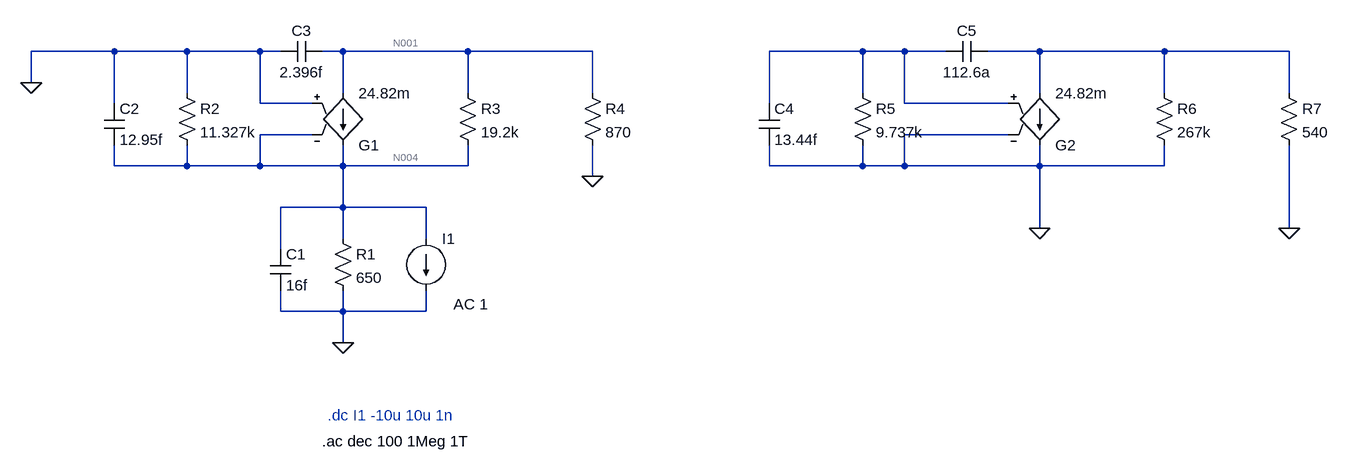
[diagram p0: schematic Draft2.asc]
Draft2.asc, the LTspice schematic file:
Version 4
SHEET 1 1604 680
WIRE -272 16 -400 16
WIRE -160 16 -272 16
WIRE -48 16 -160 16
WIRE -16 16 -48 16
WIRE 80 16 48 16
WIRE 272 16 80 16
WIRE 464 16 272 16
WIRE 880 16 736 16
WIRE 944 16 880 16
WIRE 1008 16 944 16
WIRE 1152 16 1072 16
WIRE 1344 16 1152 16
WIRE 1536 16 1344 16
WIRE -400 64 -400 16
WIRE -160 80 -160 16
WIRE 80 80 80 16
WIRE 272 80 272 16
WIRE 464 80 464 16
WIRE 880 80 880 16
WIRE 1152 80 1152 16
WIRE 1344 80 1344 16
WIRE 1536 80 1536 16
WIRE -272 96 -272 16
WIRE -48 96 -48 16
WIRE 32 96 -48 96
WIRE 736 96 736 16
WIRE 944 96 944 16
WIRE 1104 96 944 96
WIRE 32 144 -48 144
WIRE 1104 144 944 144
WIRE -272 192 -272 160
WIRE -160 192 -160 160
WIRE -160 192 -272 192
WIRE -48 192 -48 144
WIRE -48 192 -160 192
WIRE 80 192 80 160
WIRE 80 192 -48 192
WIRE 272 192 272 160
WIRE 272 192 80 192
WIRE 736 192 736 160
WIRE 880 192 880 160
WIRE 880 192 736 192
WIRE 944 192 944 144
WIRE 944 192 880 192
WIRE 1152 192 1152 160
WIRE 1152 192 944 192
WIRE 1344 192 1344 160
WIRE 1344 192 1152 192
WIRE 464 208 464 160
WIRE 80 256 80 192
WIRE 80 256 -16 256
WIRE 208 256 80 256
WIRE 1152 288 1152 192
WIRE 1536 288 1536 160
WIRE 80 304 80 256
WIRE 208 304 208 256
WIRE -16 320 -16 256
WIRE -16 416 -16 384
WIRE 80 416 80 384
WIRE 80 416 -16 416
WIRE 208 416 208 384
WIRE 208 416 80 416
WIRE 80 464 80 416
FLAG 80 464 0
FLAG -400 64 0
FLAG 464 208 0
FLAG 1152 288 0
FLAG 1536 288 0
SYMBOL current 208 304 R0
WINDOW 123 42 101 Left 2
WINDOW 39 0 0 Left 0
SYMATTR Value2 AC 1
SYMATTR InstName I1
SYMATTR Value ""
SYMBOL g2 80 176 M180
SYMATTR InstName G1
SYMATTR Value 24.82m
SYMBOL res 64 288 R0
SYMATTR InstName R1
SYMATTR Value 650
SYMBOL cap -32 320 R0
SYMATTR InstName C1
SYMATTR Value 16f
SYMBOL res -176 64 R0
SYMATTR InstName R2
SYMATTR Value 11.327k
SYMBOL res 256 64 R0
SYMATTR InstName R3
SYMATTR Value 19.2k
SYMBOL res 448 64 R0
SYMATTR InstName R4
SYMATTR Value 870
SYMBOL cap -288 96 R0
SYMATTR InstName C2
SYMATTR Value 12.95f
SYMBOL cap 48 0 R90
WINDOW 0 0 32 VBottom 2
WINDOW 3 32 32 VTop 2
SYMATTR InstName C3
SYMATTR Value 2.396f
SYMBOL cap 720 96 R0
SYMATTR InstName C4
SYMATTR Value 13.44f
SYMBOL cap 1072 0 R90
WINDOW 0 0 32 VBottom 2
WINDOW 3 32 32 VTop 2
SYMATTR InstName C5
SYMATTR Value 112.6a
SYMBOL res 864 64 R0
SYMATTR InstName R5
SYMATTR Value 9.737k
SYMBOL res 1328 64 R0
SYMATTR InstName R6
SYMATTR Value 267k
SYMBOL res 1520 64 R0
SYMATTR InstName R7
SYMATTR Value 540
SYMBOL g2 1152 176 M180
SYMATTR InstName G2
SYMATTR Value 24.82m
TEXT 48 616 Left 2 !.ac dec 100 1Meg 1T
TEXT 56 576 Left 2 ;.dc I1 -10u 10u 1n

The netlist it stands for:
* Draft2.asc
I1 N004 0 AC 1
G1 N001 N004 0 N004 24.82m
R1 N004 0 650
C1 N004 0 16f
R2 0 N004 11.327k
R3 N001 N004 19.2k
R4 N001 0 870
C2 0 N004 12.95f
C3 N001 0 2.396f
C4 N002 0 13.44f
C5 N003 N002 112.6a
R5 N002 0 9.737k
R6 N003 0 267k
R7 N003 0 540
G2 N003 0 N002 0 24.82m
.ac dec 100 1Meg 1T
* .dc I1 -10u 10u 1n
.backanno
.end

* Results of the author's LTspice run, read from the files saved beside the schematic
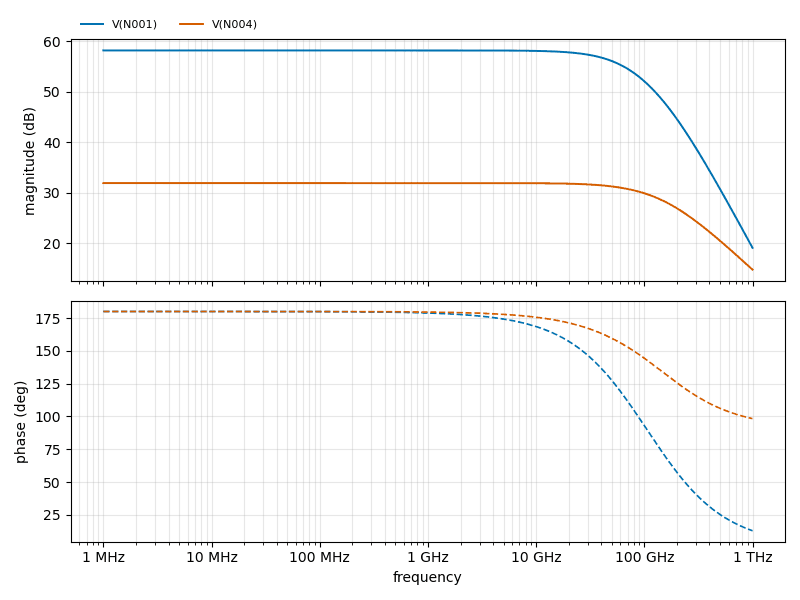
[diagram p1: AC Analysis of Draft2.asc, plotted from the saved traces]
* AC Analysis, 1 run:
*   V(N001): 58.22 dB at 1 MHz, 19.04 dB at 1 THz, peak 58.22 dB at 1 MHz, 3 dB below the peak at 61.98 GHz
*   V(N004): 31.90 dB at 1 MHz, 14.71 dB at 1 THz, peak 31.90 dB at 1 MHz, 3 dB below the peak at 132.6 GHz